# Altium schematic sheet Sheet3.SchDoc
size A4
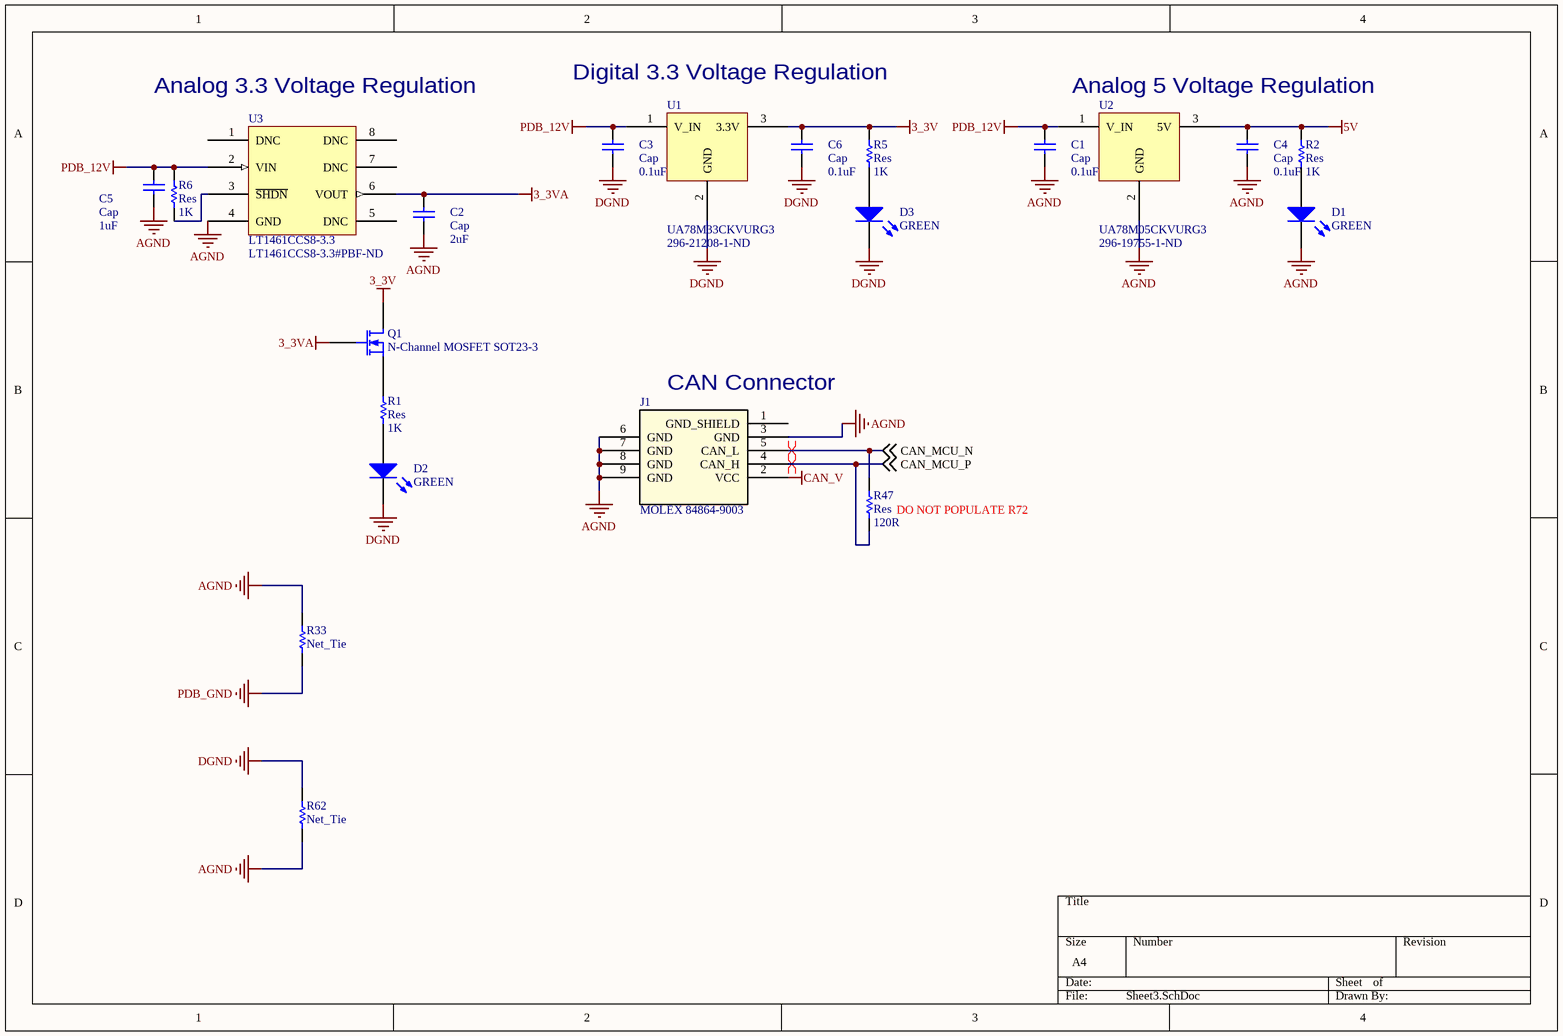
[diagram p0: Sheet3.SchDoc]

## Parts
C1  Cap  value 0.1uF  [C1206]
C2  Cap  value 2uF  [C1206]
C3  Cap  value 0.1uF  [C1206]
C4  Cap  value 0.1uF  [C1206]
C5  Cap  value 1uF  [C1206]
C6  Cap  value 0.1uF  [C1206]
D1  Colour: GREEN  [OVS5MGBCR4]  (hidden comment: OVS5MGBCR4)
D2  Colour: GREEN  [OVS5MGBCR4]  (hidden comment: OVS5MGBCR4)
D3  Colour: GREEN  [OVS5MGBCR4]  (hidden comment: OVS5MGBCR4)
J1  MOLEX 84864-9003  [MOLEX 84864-9003]
Q1  N-Channel MOSFET SOT23-3  [SOT23-3]
R1  Res  value 1K  [2012[0805]]
R2  Res  value 1K  [2012[0805]]
R5  Res  value 1K  [2012[0805]]
R6  Res  value 1K  [2012[0805]]
R33  Net_Tie  [NetTie 0805 40mil]  (net tie, no BOM)
R47  Res  value 120R  [2012[0805]]  (no BOM)
R62  Net_Tie  [NetTie 0805 40mil]  (net tie, no BOM)
U1  UA78M33CKVURG3  Supplier Part Number 1: 296-21208-1-ND  [TO-252-3]
U2  UA78M05CKVURG3  Supplier Part Number 1: 296-19755-1-ND  [TO-252-3]
U3  LT1461CCS8-3.3  Supplier Part Number 1: LT1461CCS8-3.3#PBF-ND  [SOIC-8-150]

## Nets
3_3V: C6.2 Q1.3(D) R5.2 U1.3(3.3V)
3_3VA: C2.2 Q1.1(G) U3.6(VOUT)
5V: C4.2 R2.2 U2.3(5V)
AGND: C1.1 C2.1 C4.1 C5.1 D1.2(K) J1.3(GND) J1.6(GND) J1.7(GND) J1.8(GND) J1.9(GND) R33.2 R62.1 U2.2(GND) U3.4(GND)
CAN_V: J1.2(VCC)
DGND: C3.1 C6.1 D2.2(K) D3.2(K) R62.2 U1.2(GND)
PDB_12V: C1.2 C3.2 C5.2 R6.2 U1.1(V_IN) U2.1(V_IN) U3.2(VIN)
PDB_GND: R33.1
CAN_MCU_N: J1.5(CAN_L) R47.1 ; off-sheet CAN_MCU_N
CAN_MCU_P: J1.4(CAN_H) R47.2 ; off-sheet CAN_MCU_P
NetD1_1: D1.1(A) R2.1
NetD2_1: D2.1(A) R1.1
NetD3_1: D3.1(A) R5.1
NetQ1_2: Q1.2(S) R1.2
NetR6_1: R6.1 U3.3(~{SHDN})

Not connected (* = marked no-connect by the designer): J1 1(GND_SHIELD); U3 1(DNC) 5(DNC) 7(DNC) 8(DNC)

## Layout directives
differential pair: (no net found under the mark)

## Notes on the sheet
- (near U3) Analog 3.3 Voltage Regulation
- Digital 3.3 Voltage Regulation
- Analog 5 Voltage Regulation
- (near J1) CAN Connector
- (near R47) DO NOT POPULATE R72

## Library data of the parts
C1-C6 = Cap: Capacitor; Published: 8-Jun-2000; LatestRevisionDate: 17-Jul-2002; LatestRevisionNote: Re-released for DXP Platform.; PackageReference: C1206; Publisher: Altium Limited
D1-D3 = OVS5MGBCR4: Typical GREEN LED; Published: 8-Jun-2000; LatestRevisionDate: 17-Jul-2002; LatestRevisionNote: Re-released for DXP Platform.; PackageDocument: Feb-2002; PackageReference: 3.2X1.6X1.1; Publisher: Altium Limited; Supplier 1: Digi-Key; Supplier Part Number 1: 365-1545-1-ND
J1 = MOLEX 84864-9003: CAN Micro-Change M12, Right Angle, Male
Q1 = MOSFET-N SOT23-3
R1 R2 R5 R6 R47 = Res: Surface Mount Resistor; Published: 8-Jun-2000; LatestRevisionDate: 17-Jul-2002; LatestRevisionNote: Re-released for DXP Platform.; PackageReference: AXIAL-0.5; Publisher: Altium Limited
R33 R62 = Res_NetTie: Surface Mount Resistor
U1 = UA78M33CKVURG3: 3.3V Regulator; Supplier 1: Digi-Key
U2 = UA78M05CKVURG3: 5.0V Regulator; Supplier 1: Digi-Key
U3 = LT1461CCS8-3.3: IC VREF SERIES 3.3V 8SOIC; Supplier 1: Digi-Key